# EAGLE design pwm4 (EAGLE 6.5.0)
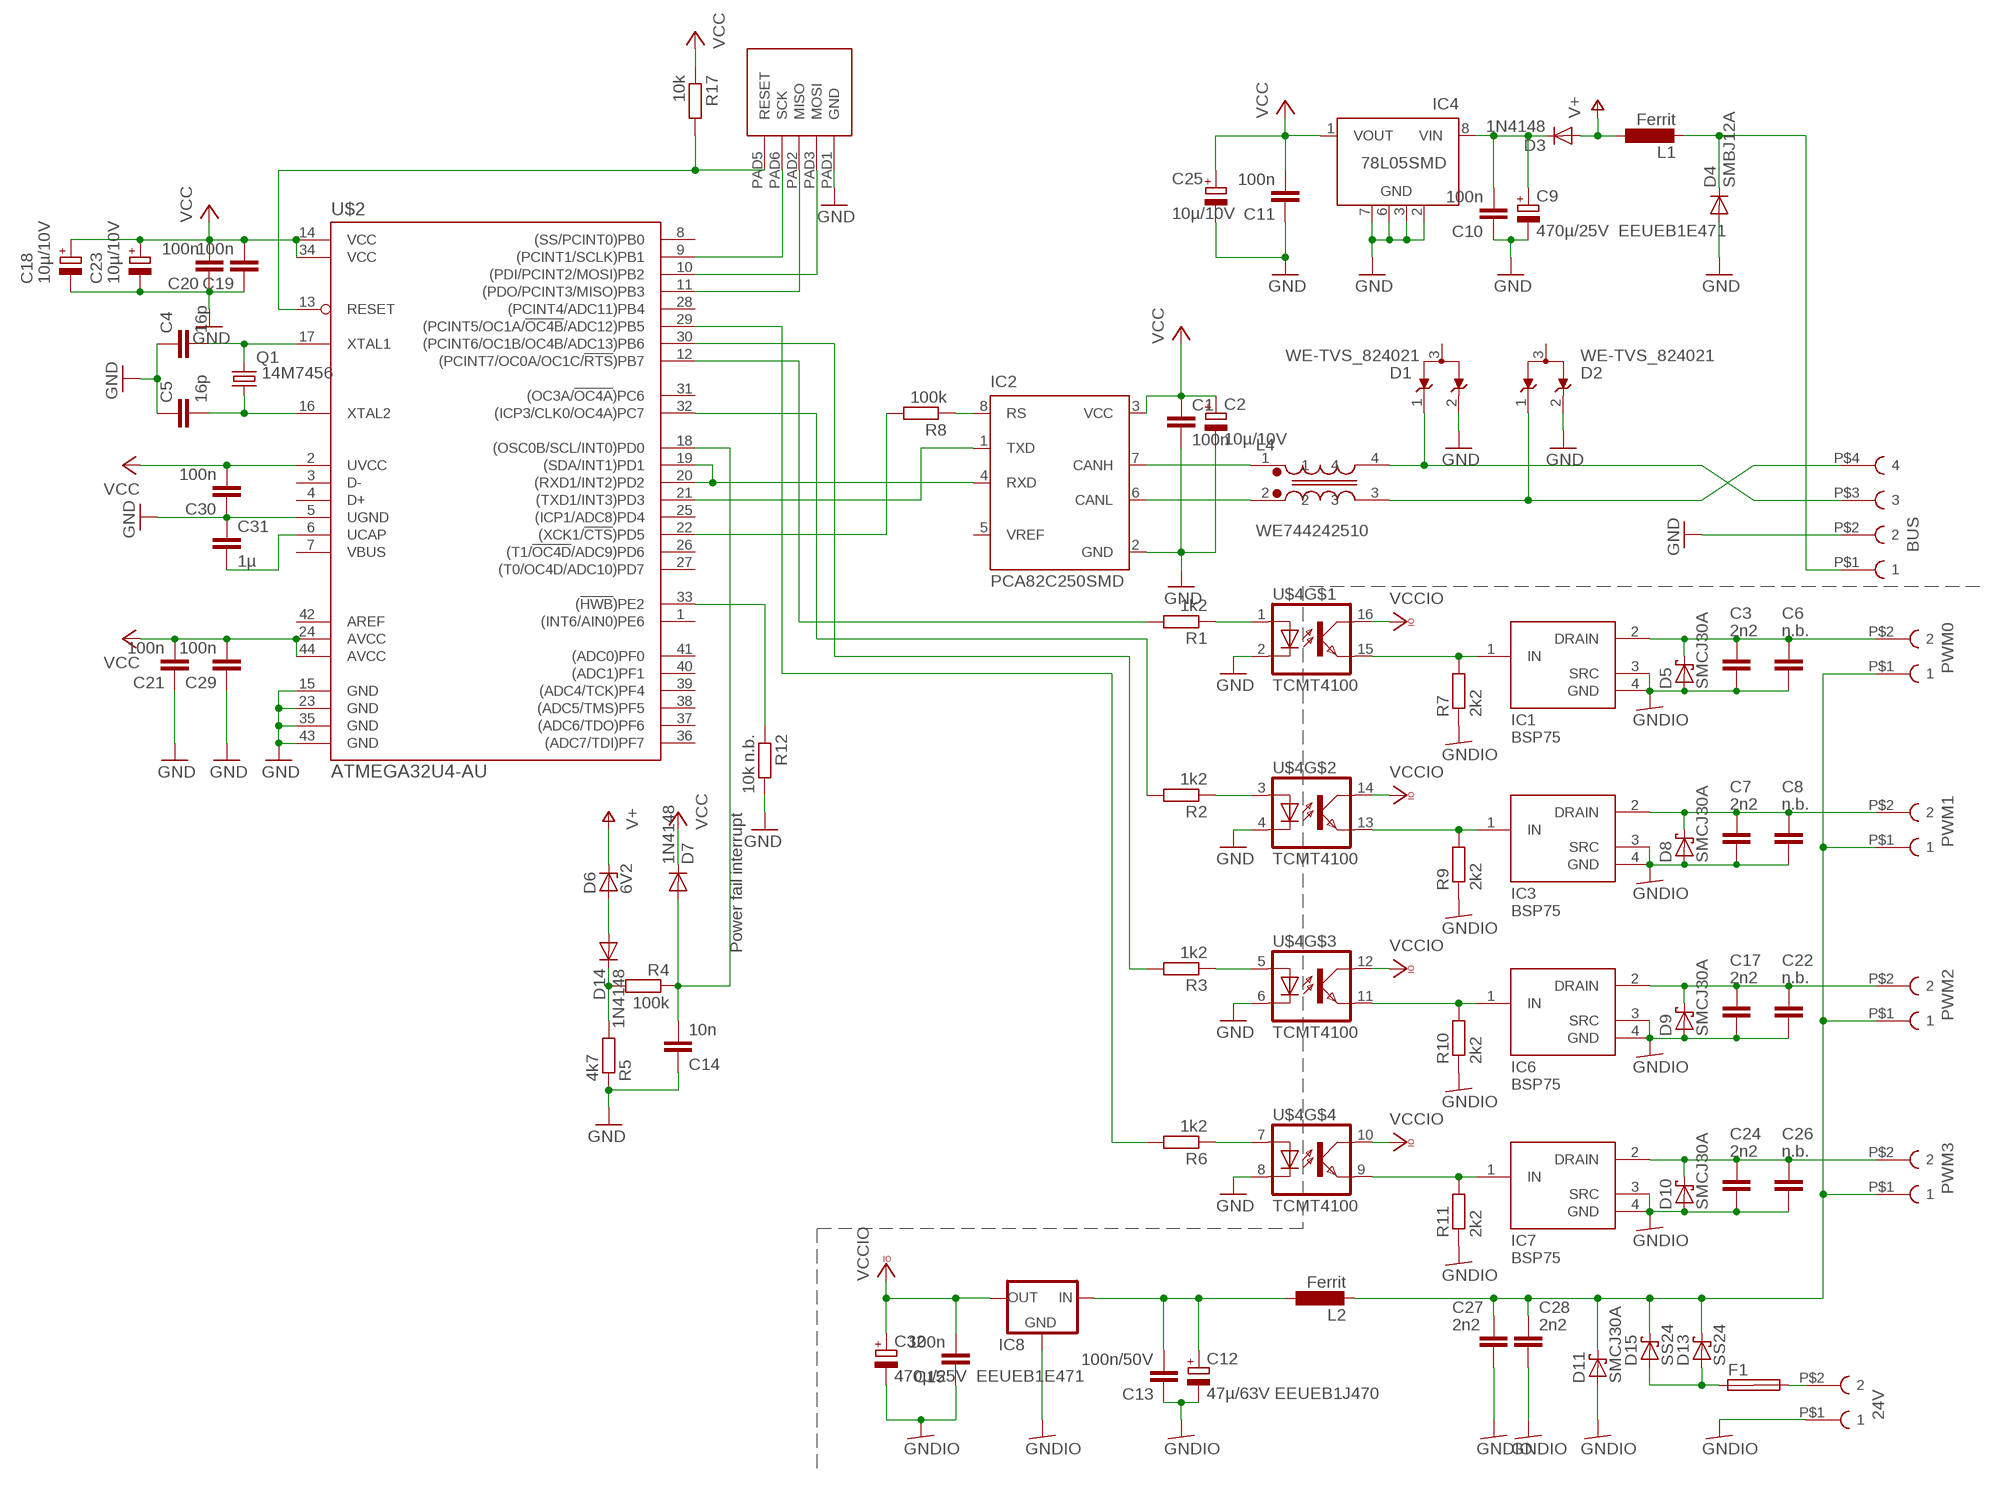
[diagram p0: schematic, sheet 1]

## Parts
24V  TBG-3.5-PW-2P  [TBG-3.5-PW-2P]
BUS  TBG-3.5-PW-4P  [TBG-3.5-PW-4P]
C1  100n  C-EUC0603  [C0603]
C2  10µ/10V  CPOL-EUA/3216-18W  [A/3216-18W]
C3  2n2  C-EU025-040X050  [C025-040X050]
C4  16p  C-EUC0603  [C0603]
C5  16p  C-EUC0603  [C0603]
C6  n.b.  C-EU025-040X050  [C025-040X050]
C7  2n2  C-EU025-040X050  [C025-040X050]
C8  n.b.  C-EU025-040X050  [C025-040X050]
C9  470µ/25V EEUEB1E471  CPOL-EUE5-10.5  [E5-10,5]
C10  100n  C-EUC0603  [C0603]
C11  100n  C-EUC0603  [C0603]
C12  47µ/63V EEUEB1J470  CPOL-EUE3.5-8  [E3,5-8]
C13  100n/50V  C-EUC0603  [C0603]
C14  10n  C-EUC0603  [C0603]
C15  100n  C-EUC0603  [C0603]
C17  2n2  C-EU025-040X050  [C025-040X050]
C18  10µ/10V  CPOL-EUA/3216-18W  [A/3216-18W]
C19  100n  C-EUC0603  [C0603]
C20  100n  C-EUC0603  [C0603]
C21  100n  C-EUC0603  [C0603]
C22  n.b.  C-EU025-040X050  [C025-040X050]
C23  10µ/10V  CPOL-EUA/3216-18W  [A/3216-18W]
C24  2n2  C-EU025-040X050  [C025-040X050]
C25  10µ/10V  CPOL-EUA/3216-18W  [A/3216-18W]
C26  n.b.  C-EU025-040X050  [C025-040X050]
C27  2n2  C-EU025-040X050  [C025-040X050]
C28  2n2  C-EU025-040X050  [C025-040X050]
C29  100n  C-EUC0603  [C0603]
C30  100n  C-EUC0603  [C0603]
C31  1µ  C-EUC1210K  [C1210K]
C32  470µ/25V EEUEB1E471  CPOL-EUE5-10.5  [E5-10,5]
D1  WE-TVS_824021  [WE-TVS_SOT23-3L]
D2  WE-TVS_824021  [WE-TVS_SOT23-3L]
D3  1N4148  DIODE-SOD80C  [SOD80C]
D4  SMBJ12A  DIODE-SMB  [SMB]
D5  SMCJ30A  SCHOTTKY-DIODESMC  [SMC]
D6  6V2  ZENER-DIODESOD80C  [SOD80C]
D7  1N4148  DIODE-SOD80C  [SOD80C]
D8  SMCJ30A  SCHOTTKY-DIODESMC  [SMC]
D9  SMCJ30A  SCHOTTKY-DIODESMC  [SMC]
D10  SMCJ30A  SCHOTTKY-DIODESMC  [SMC]
D11  SMCJ30A  SCHOTTKY-DIODESMC  [SMC]
D13  SS24  SCHOTTKY-DIODESMD  [SMB]
D14  1N4148  DIODE-SOD80C  [SOD80C]
D15  SS24  SCHOTTKY-DIODESMD  [SMB]
F1  SHK20L  [SHK20L]
IC1  BSP75  [SOT223]
IC2  PCA82C250SMD  [SO8]
IC3  BSP75  [SOT223]
IC4  78L05SMD  [SO08]
IC6  BSP75  [SOT223]
IC7  BSP75  [SOT223]
IC8  78XXS  [78XXS]
L1  Ferrit  L-EUL1806  [L1806]
L2  Ferrit  L-EUL1806  [L1806]
L4  WE744242510  WE-SLM  [WE-SLM]
PWM0  TBG-3.5-PW-2P  [TBG-3.5-PW-2P]
PWM1  TBG-3.5-PW-2P  [TBG-3.5-PW-2P]
PWM2  TBG-3.5-PW-2P  [TBG-3.5-PW-2P]
PWM3  TBG-3.5-PW-2P  [TBG-3.5-PW-2P]
Q1  14M7456  CRYSTALSM49  [SM49]
R1  1k2  R-EU_R0603  [R0603]
R2  1k2  R-EU_R0603  [R0603]
R3  1k2  R-EU_R0603  [R0603]
R4  100k  R-EU_R0603  [R0603]
R5  4k7  R-EU_R0603  [R0603]
R6  1k2  R-EU_R0603  [R0603]
R7  2k2  R-EU_R0603  [R0603]
R8  100k  R-EU_R0603  [R0603]
R9  2k2  R-EU_R0603  [R0603]
R10  2k2  R-EU_R0603  [R0603]
R11  2k2  R-EU_R0603  [R0603]
R12  10k n.b.  R-EU_R0603  [R0603]
R17  10k  R-EU_R0603  [R0603]
U$1  ATMEL_ISP  [ATMEL_ISP]
U$2  ATMEGA32U4-AU  [TQFP44]
U$4  TCMT4100  [SOIC16]

## Nets
#RESET: R17.2 U$1.PAD5(RESET) U$2.13(RESET)
B+: BUS.P$3 D1.1 L4.4
B-: BUS.P$4 D2.1 L4.3
GND: BUS.P$2 C1.2 C2.- C4.1 C5.1 C9.- C10.1 C11.1 C14.1 C18.- C19.1 C20.1 C21.1 C23.- C25.- C29.1 C30.1 C31.1 D1.2 D2.2 D4.A IC2.2(GND) IC4.2(GND) IC4.3(GND) IC4.6(GND) IC4.7(GND) R5.1 R12.2 U$1.PAD1(GND) U$2.5(UGND) U$2.15(GND) U$2.23(GND) U$2.35(GND) U$2.43(GND) U$4.2(C) U$4.4(C) U$4.6(C) U$4.8(C)
GNDIO: 24V.P$1 C3.1 C6.1 C7.1 C8.1 C12.- C13.1 C15.1 C17.1 C22.1 C24.1 C26.1 C27.1 C28.1 C32.- D5.A D8.A D9.A D10.A D11.A IC1.3(SRC) IC1.4(GND) IC3.3(SRC) IC3.4(GND) IC6.3(SRC) IC6.4(GND) IC7.3(SRC) IC7.4(GND) IC8.GND R7.1 R9.1 R10.1 R11.1
MISO: U$1.PAD2(MISO) U$2.11((PDO/PCINT3/MISO)PB3)
MOSI: U$1.PAD3(MOSI) U$2.10((PDI/PCINT2/MOSI)PB2)
N$1: R8.2 U$2.22((XCK1/!CTS!)PD5)
N$2: C3.2 C6.2 D5.C IC1.2(DRAIN) PWM0.P$2
N$3: IC2.1(TXD) U$2.21((TXD1/INT3)PD3)
N$4: C9.+ C10.2 D3.C IC4.8(VIN)
N$9: C7.2 C8.2 D8.C IC3.2(DRAIN) PWM1.P$2
N$10: IC2.7(CANH) L4.1
N$11: R1.1 U$4.1(A)
N$12: IC2.4(RXD) U$2.19((SDA/INT1)PD1) U$2.20((RXD1/INT2)PD2)
N$13: C17.2 C22.2 D9.C IC6.2(DRAIN) PWM2.P$2
N$14: C24.2 C26.2 D10.C IC7.2(DRAIN) PWM3.P$2
N$15: C4.2 Q1.2 U$2.17(XTAL1)
N$16: C5.2 Q1.1 U$2.16(XTAL2)
N$17: IC2.6(CANL) L4.2
N$18: C12.+ C13.2 IC8.IN L2.1
N$19: C27.2 C28.2 D11.C D13.C D15.C L2.2 PWM0.P$1 PWM1.P$1 PWM2.P$1 PWM3.P$1
N$20: BUS.P$1 D4.C L1.2
N$21: 24V.P$2 F1.2A
N$22: D6.A D14.A
N$23: D13.A D15.A F1.1A
N$24: R2.1 U$4.3(A)
N$25: R3.1 U$4.5(A)
N$26: R6.1 U$4.7(A)
N$27: IC2.8(RS) R8.1
N$28: D14.C R4.2 R5.2
N$29: IC1.1(IN) R7.2 U$4.15(EMIT)
N$30: IC3.1(IN) R9.2 U$4.13(EMIT)
N$31: IC6.1(IN) R10.2 U$4.11(EMIT)
N$32: IC7.1(IN) R11.2 U$4.9(EMIT)
N$36: C31.2 U$2.6(UCAP)
N$37: R12.1 U$2.33((!HWB!)PE2)
N$39: C14.2 D7.A R4.1 U$2.18((OSC0B/SCL/INT0)PD0)
PWM0: R1.2 U$2.12((PCINT7/OC0A/OC1C/!RTS!)PB7)
PWM1: R2.2 U$2.32((ICP3/CLK0/OC4A)PC7)
PWM2: R3.2 U$2.30((PCINT6/OC1B/OC4B/ADC13)PB6)
PWM3: R6.2 U$2.29((PCINT5/OC1A/!OC4B!/ADC12)PB5)
SCK: U$1.PAD6(SCK) U$2.9((PCINT1/SCLK)PB1)
V+: D3.A D6.C L1.1
VCC: C1.1 C2.+ C11.2 C18.+ C19.2 C20.2 C21.2 C23.+ C25.+ C29.2 C30.2 D7.C IC2.3(VCC) IC4.1(VOUT) R17.1 U$2.2(UVCC) U$2.14(VCC) U$2.24(AVCC) U$2.34(VCC) U$2.44(AVCC)
VCCIO: C15.2 C32.+ IC8.OUT U$4.10(COL) U$4.12(COL) U$4.14(COL) U$4.16(COL)
Unconnected: D1.3(GND) D2.3(GND) F1.1B F1.2B IC2.5(VREF) IC4.4(NC) IC4.5(NC) U$2.1((INT6/AIN0)PE6) U$2.3(D-) U$2.4(D+) U$2.7(VBUS) U$2.8((SS/PCINT0)PB0) U$2.25((ICP1/ADC8)PD4) U$2.26((T1/!OC4D!/ADC9)PD6) U$2.27((T0/OC4D/ADC10)PD7) U$2.28((PCINT4/ADC11)PB4) U$2.31((OC3A/!OC4A!)PC6) U$2.36((ADC7/TDI)PF7) U$2.37((ADC6/TDO)PF6) U$2.38((ADC5/TMS)PF5) U$2.39((ADC4/TCK)PF4) U$2.40((ADC1)PF1) U$2.41((ADC0)PF0) U$2.42(AREF)

## Notes on the sheet
- Power fail interrupt

## Library data of the parts
24V PWM0 PWM1-PWM3 = mylib:TBG-3.5-PW-2P
BUS = mylib:TBG-3.5-PW-4P
C1 C3-C8 C10 C11 C13-C15 C17 C19-C22 C24 C26-C30 = resistor:C-EU: CAPACITOR, European symbol
C2 C9 C12 C18 C23 C25 C32 = rcl:CPOL-EU: POLARIZED CAPACITOR, European symbol
C31 = rcl:C-EU: CAPACITOR, European symbol
D1 D2 = EagleLibrary_Wuerth_Elektronik_eiSos_V6_20140807:WE-TVS_824021: TVS Diode Array WE-TVS, Standard Series - Low capazity - No leakage current - Low clamping voltage - high ESD voltage protection - Uni- and bidirectional protection -- DC Distribution -- Headsets and Accessoires -- PDAs -- Digital Cameras -- MP3-Players -- Touch Panels <http://katalog.we-online.de/media/images/eisos/VarTVS_highspeed_pf2.jpg.jpg> Details see: http://katalog.we-online.de/en/pbs/WE-TVS_High_Speed? Updated by Dan Xu 2014-07-11 2014 (C) Würth Elektronik
D3 D4 D7 D14 = diode:DIODE-: DIODE
D5 D8-D11 D13 D15 = diode:SCHOTTKY-DIODE: Schottky Diode
D6 = diode:ZENER-DIODE: Z-Diode
F1 = fuse:SHK20L: FUSE HOLDER 5 x 20 mm, SH contact, SHH1 Schukat, E1073 Buerklin; OC_FARNELL: unknown; OC_NEWARK: unknown
IC1 IC3 IC6 IC7 = mylib:BSP75
IC2 = mylib:PCA82C250: CAN CONTROLLER INTERFACE
IC4 = linear:78L*SMD: Positive VOLTAGE REGULATOR
IC8 = v-reg:78XXS: VOLTAGE REGULATOR
L1 L2 = mylib:L-EU: INDUCTOR, European symbol
L4 = EagleLibrary_Wuerth_Elektronik_eiSos_V6_20140807:WE-SLM: SMD Common Mode Line Filter WE-SLM - Small size - Low Profile - High Impedance - High current capability up to 300 mA -- USB -- CAN -- Firewire -- Data Lines -- Power supply systems -- Signal Lines <http://katalog.we-online.de/media/images/eisos/IndSLM_pf2.jpg> Details see: http://katalog.we-online.de/en/pbs/WE-SLM?? Updated by Dan Xu 2014-07-11 2014 (C) Würth Elektronik
Q1 = crystal:CRYSTAL: CRYSTAL; OC_FARNELL: unknown; OC_NEWARK: unknown
R1-R12 R17 = resistor:R-EU_: RESISTOR, European symbol
U$1 = mylib:ATMEL_ISP
U$2 = mega32U4:ATMEGA32U4-AU: ATMega32U4-AU Library by: http://projects.weber-itam.de
U$4 = mylib:TCMT4100

## Net classes
0 default: clearance 0.205 mm

## Board
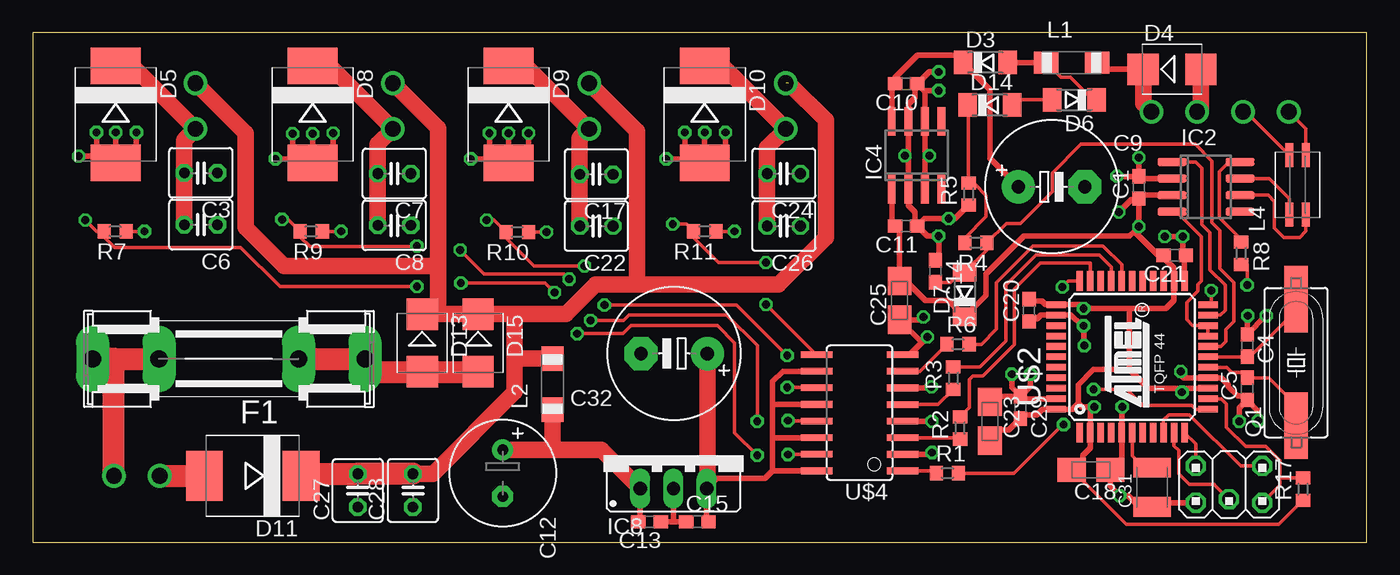
[diagram p1: board, top side]
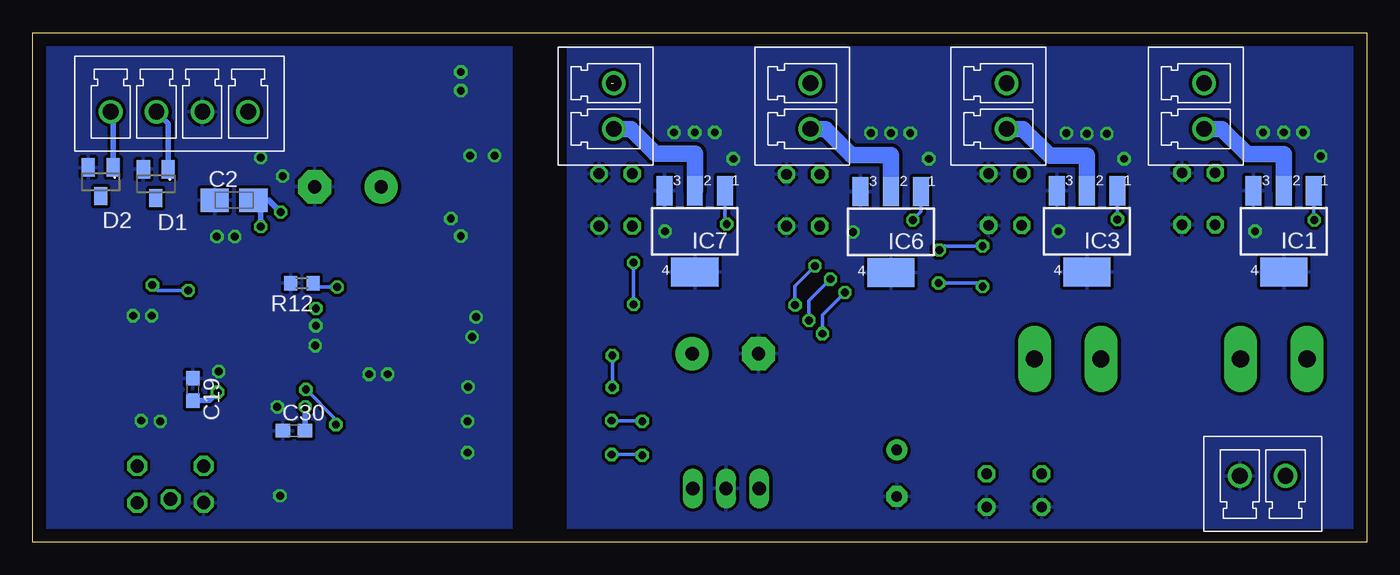
[diagram p2: board, bottom side, seen from below]

Size 101.96 x 38.96 mm. Coordinates in mm from the lower left corner, seen from the top.
Outline: 0,0 101.96,0 101.96,38.96 0,38.96 0,0
Copper layers (1*16): Top 0.035mm / dielectric 1.5mm / Bottom 0.035mm
Design rules "Bilex DRU *": minimum track width 10mil, minimum drill 23mil, track to track 10mil, track to pad 10mil, pad to pad 10mil, via to via 10mil, smd to smd 10mil, copper to edge 40mil, drill to drill 8mil, minimum pad ring 10mil, minimum via ring 8mil, stop-mask expansion 4mil, vias tented up to drill 0mil, thermal gap 10mil

### Footprints (pad centres in the part's own frame; a part is rotated, then mirrored left to right if it is on the bottom)
TBG-3.5-PW-2P = drill 1.2: P$1 0,0; P$2 3.5,0
TBG-3.5-PW-4P = drill 1.2: P$1 0,0; P$2 3.5,0; P$3 7,0; P$4 10.5,0
C0603 = smd 1.1 x 1: 1 -0.85,0; 2 0.85,0
A/3216-18W = smd 2.15 x 1.8: + 1.475,0; - -1.475,0
C025-040X050 = drill 0.813 octagon: 1 -1.27,0; 2 1.27,0
E5-10,5 = drill 1.016 pad 2.54: + -2.54,0 | drill 1.016 pad 2.54 octagon: - 2.54,0
E3,5-8 = drill 0.813 pad 1.6: + -1.778,0 | drill 0.813 pad 1.6 octagon: - 1.778,0
C1210K = smd 1.5 x 2.9: 1 -1.5,0; 2 1.5,0
WE-TVS_SOT23-3L = smd 1 x 1.4: 1 -0.95,-1.1; 2 0.95,-1.1; 3 0,1.1
SOD80C = smd 1.4 x 1.8: A 1.7,0; C -1.7,0
SMB = smd 2.4 x 2.4: A 2.2,0; C -2.2,0
SMC = smd 2.8 x 3.8: A 3.7,0; C -3.7,0
SHK20L = drill 1.321 pad 2.54 long: 1A -10.414,0; 1B -5.334,0; 2A 10.414,0; 2B 5.334,0
SOT223 = smd 1.219 x 2.235: 1 -2.311,-3.099; 2 0,-3.099; 3 2.311,-3.099 | smd 3.6 x 2.2: 4 0,3.099
SO8 = smd 0.6 x 2.2: 1 -1.905,-2.6; 2 -0.635,-2.6; 3 0.635,-2.6; 4 1.905,-2.6; 5 1.905,2.6; 6 0.635,2.6; 7 -0.635,2.6; 8 -1.905,2.6
SO08 = smd 0.6 x 2.2: 1 -1.905,-2.6; 2 -0.635,-2.6; 3 0.635,-2.6; 4 1.905,-2.6; 5 1.905,2.6; 6 0.635,2.6; 7 -0.635,2.6; 8 -1.905,2.6
78XXS = drill 1.016 long: GND 0,-2.54; IN -2.54,-2.54; OUT 2.54,-2.54
L1806 = smd 1.9 x 1.7: 1 -0.68,0; 2 3.22,0
WE-SLM = smd 1.85 x 0.6: 1 -2.28,0.63; 2 -2.28,-0.62; 3 2.27,-0.62; 4 2.27,0.63
SM49 = smd 5.08 x 1.778: 1 -4.826,0; 2 4.826,0
R0603 = smd 1 x 1.1: 1 -0.85,0; 2 0.85,0
ATMEL_ISP = drill 1.016 octagon: PAD1 1.397,-2.54; PAD2 -1.41,-2.54; PAD3 1.13,0; PAD5 1.41,2.54; PAD6 -1.41,2.54
TQFP44 = smd 1.5 x 0.5: 1 -5.8,4; 2 -5.8,3.2; 3 -5.8,2.4; 4 -5.8,1.6; 5 -5.8,0.8; 6 -5.8,0; 7 -5.8,-0.8; 8 -5.8,-1.6; 9 -5.8,-2.4; 10 -5.8,-3.2; 11 -5.8,-4; 23 5.8,-4; 24 5.8,-3.2; 25 5.8,-2.4; 26 5.8,-1.6; 27 5.8,-0.8; 28 5.8,0; 29 5.8,0.8; 30 5.8,1.6; 31 5.8,2.4; 32 5.8,3.2; 33 5.8,4 | smd 0.5 x 1.5: 12 -4,-5.8; 13 -3.2,-5.8; 14 -2.4,-5.8; 15 -1.6,-5.8; 16 -0.8,-5.8; 17 0,-5.8; 18 0.8,-5.8; 19 1.6,-5.8; 20 2.4,-5.8; 21 3.2,-5.8; 22 4,-5.8; 34 4,5.8; 35 3.2,5.8; 36 2.4,5.8; 37 1.6,5.8; 38 0.8,5.8; 39 0,5.8; 40 -0.8,5.8; 41 -1.6,5.8; 42 -2.4,5.8; 43 -3.2,5.8; 44 -4,5.8
SOIC16 = smd 0.508 x 2.413: 1 -4.445,-3.281; 2 -3.185,-3.281; 3 -1.915,-3.281; 4 -0.645,-3.281; 5 0.625,-3.281; 6 1.895,-3.281; 7 3.165,-3.281; 8 4.435,-3.281; 9 4.445,3.281; 10 3.175,3.281; 11 1.905,3.281; 12 0.635,3.281; 13 -0.635,3.281; 14 -1.905,3.281; 15 -3.175,3.281; 16 -4.445,3.281

### Placement (x,y rotation side)
24V  9.7,5.08 0 bottom
BUS  85.5,32.92 180 bottom
C1  84.53,27.13 90 top
C2  86.56,26.16 0 bottom
C3  12.85,28.24 180 top
C4  92.81,15.04 270 top
C5  92.81,11.73 90 top
C6  12.85,24.28 180 top
C7  27.64,28.19 180 top
C8  27.64,24.23 180 top
C9  77.88,27.18 0 top
C10  66.75,35.05 180 top
C11  66.75,24.18 180 top
C12  35.92,5.28 270 top
C13  47.14,1.57 180 top
C14  68.99,20.73 270 top
C15  50.8,1.57 0 top
C17  43.08,28.14 180 top
C18  80.87,5.54 180 top
C19  89.71,11.68 270 bottom
C20  76.15,17.73 90 top
C21  87.27,21.95 180 top
C22  43.08,24.18 180 top
C23  73.15,9.25 270 top
C24  57.4,28.19 180 top
C25  66.24,18.49 90 top
C26  57.4,24.18 180 top
C27  24.84,3.96 90 top
C28  29.06,3.96 90 top
C29  75.49,10.31 270 top
C30  81.99,8.53 0 bottom
C31  85.55,4.22 90 top
C32  49.02,14.43 180 top
D1  92.54,27.41 180 bottom
D2  96.76,27.57 180 bottom
D3  72.8,36.68 0 top
D4  87.07,36.17 0 top
D5  6.35,32.72 270 top
D6  79.6,33.83 180 top
D7  71.22,18.95 90 top
D8  21.39,32.72 270 top
D9  36.37,32.72 270 top
D10  51.36,32.72 270 top
D11  16.81,5.08 180 top
D13  29.77,15.24 270 top
D14  73.15,33.43 0 top
D15  34.04,15.24 270 top
F1  14.99,14.02 180 top
IC1  6.35,23.77 180 bottom
IC2  89.66,27.18 270 top
IC3  21.39,23.77 180 bottom
IC4  67.55,29.58 0 top
IC6  36.37,23.72 180 bottom
IC7  51.36,23.77 180 bottom
IC8  48.97,6.65 0 top
L1  78.13,36.68 0 top
L2  39.73,10.82 90 top
L4  96.67,27.33 90 top
PWM0  12.45,35.1 270 bottom
PWM1  27.53,35.1 270 bottom
PWM2  42.52,35.1 270 bottom
PWM3  57.56,35.1 270 bottom
Q1  96.56,13.74 90 top
R1  69.9,5.28 0 top
R2  70.87,8.74 90 top
R3  70.36,12.55 90 top
R4  72.09,22.91 180 top
R5  71.53,26.62 90 top
R6  70.71,15.14 0 top
R7  6.3,23.77 180 top
R8  92.35,22.1 270 top
R9  21.29,23.77 180 top
R10  37.03,23.72 180 top
R11  51.36,23.77 180 top
R12  81.38,19.81 180 bottom
R17  97.08,4.06 90 top
U$1  91.43,4.42 270 top
U$2  84.02,14.17 90 top
U$4  63.2,9.91 90 top

### Tracks (layer width: path | path; a pad name or v marks a point on that pad's centre or on a via)
#RESET
  Top 0.254: 95.3,4.83 95.3,6.25 94.23,7.32 92.71,7.32 91.24,8.79 91.24,10.57 90.83,10.97 U$2.13 | 95.3,4.83 95.3,4.35 U$1.PAD5 | R17.2 95.39,4.91 95.3,4.83
B+
  Top 0.254: L4.4 92.72,32.92 BUS.P$3
  Bottom 0.406: BUS.P$3 91.59,32.02 D1.1
B-
  Top 0.254: L4.3 97.29,31.62 BUS.P$4
  Bottom 0.406: BUS.P$4 95.81,32.73 D2.1
GND  (via drill 0.6)
  Top 0.254: 80.31,15.09 v80.37,15.04
  Top 0.406: IC4.3 68.19,29.23 v68.53,29.57 68.19,29.91 IC4.6 68.19,34.46 | 68.19,34.46 C10.1 | v69.24,35.97 68.52,35.97 C10.1 | v69.24,34.54 68.27,34.54 68.19,34.46 | C10.1 67.41,34.86 67.41,33.98 66.92,33.49 IC4.7 66.92,29.84 v66.65,29.57 66.92,29.3 IC4.2 66.92,25.74 67.41,25.25 67.41,24.37 C11.1 | v69.24,23.42 68.36,23.42 C11.1 | U$4.8 67.02,14.34 67.94,15.27 | 67.94,15.27 v68.38,15.7 | v68.07,17.22 67.87,17.02 C25.- 66.24,16.97 67.94,15.27 | 80.31,15.09 v80.31,16.56 80.16,16.56 79.35,17.37 U$2.35 77.06,17.37 76.76,17.07 76.34,17.07 C20.1 | 69.19,23.37 v69.24,23.42 | v87.73,13.06 87.73,12.8 87.96,12.57 U$2.15 90.86,12.57 91.39,12.04 91.39,11.89 92.1,11.18 92.52,11.18 C5.1 | v83.26,10.36 83.22,10.36 U$2.5 83.22,6.41 C18.- 82.35,4.26 v83.06,3.56 83.72,3.56 84.48,2.79 85.47,2.79 C31.1 85.86,3.03 U$1.PAD1 | C5.1 92.2,10.28 v92.2,9.25 | v93.67,9.3 93.67,10.02 C5.1 | v92.86,17.32 92.81,17.27 C4.1 94.25,17.32 v94.28,17.32 | U$2.43 75.68,10.97 C29.1 | C23.- 73.59,11.16 C29.1 | C29.1 74.83,11.82 v74.83,12.85 | v76.25,12.85 76.25,11.92 C29.1 | U$4.6 68.59,11.8 v68.68,11.89 | U$4.4 68.72,9.26 v68.73,9.25 | U$4.2 68.59,6.72 v68.73,6.86 | C14.1 69.24,21.83 v69.24,23.42 | v84.53,29.41 C1.2 | C1.2 84.69,27.81 IC2.2 | U$2.23 88.02,21.84 C21.1 87.88,22.19 v87.88,23.37 v86.51,23.37 | C11.1 68.16,24.74 v70,24.74 70.5,24.74 R5.1 | C1.2 82.87,27.98 v82.86,27.99
  Top 1.27: D4.A 89.27,33.19 BUS.P$2
  pour Bottom: 101.8,38.81 101.8,0.15 65.38,0.15 65.38,38.81
GNDIO  (via drill 0.6)
  Top 0.254: R10.1 v39.27,23.72 | R11.1 v53.65,23.77 | R7.1 v8.53,23.77 | R9.1 v23.57,23.77
  Top 0.406: v7.92,31.34 7.92,29.02 D5.A | v3.5,29.52 6.35,29.52 D5.A | v4.88,31.34 4.88,29.02 D5.A | v6.35,31.34 D5.A | v22.96,31.29 22.96,29.02 D8.A | v19.86,31.24 19.86,29.02 D8.A | v18.54,29.31 21.39,29.31 D8.A | v21.39,31.24 D8.A | v37.9,31.29 37.9,29.02 D9.A | v34.9,31.29 34.9,29.02 D9.A | v33.48,29.31 36.37,29.31 D9.A | v36.37,31.29 D9.A | v52.93,31.34 52.93,29.02 D10.A | v49.84,31.34 49.84,29.02 D10.A | v48.41,29.31 51.36,29.31 D10.A | v51.36,31.34 D10.A | C13.1 C15.1 48.97,1.57 IC8.GND
  Top 1.676: 24V.P$1 D11.A
  pour Bottom: 0.15,0.15 61.01,0.15 61.01,38.81 0.15,38.81
MISO
  Top 0.254: U$2.11 88.89,7.51 U$1.PAD2
MOSI
  Top 0.254: U$1.PAD3 90.46,4.26 90.35,4.37 90.3,4.42 88.39,4.42 87.58,5.23 87.58,7.01 87.22,7.37 U$2.10
N$1  (via drill 0.6)
  Top 0.254: U$2.22 89.76,18.23 90.07,18.23 v90.07,19.25 | R8.2 92.81,21.25 v92.81,19.66
  Bottom 0.254: v90.07,19.25 92.41,19.25 v92.81,19.66
N$2
  Top 1.27: D5.C 7.63,36.41 PWM0.P$2 11.58,30.74 C3.2 C6.2
  Bottom 1.27: IC1.2 6.35,29.67 9.14,29.67 11.08,31.6 PWM0.P$2
N$3
  Top 0.254: 89.87,17.32 U$2.21 90.78,17.37 91.14,17.73 91.14,19.66 89.97,20.83 89.97,23.67 89.36,24.28 89.36,28.6 88.88,29.08 IC2.1
N$4
  Top 0.406: IC4.8 65.65,34.8 C10.2 65.9,35.52 67.61,37.24 70.61,37.24 71.1,36.75 D3.C 73.15,34.62 73.15,29.36 C9.+
N$9
  Top 1.27: D8.C 22.72,36.41 PWM1.P$2 26.36,30.43 C7.2 C8.2
  Bottom 1.27: IC3.2 21.39,29.57 24.23,29.57 26.27,31.6 PWM1.P$2
N$10
  Top 0.254: IC2.7 94.51,27.81 96.04,26.28 L4.1
N$11
  Top 0.254: U$4.1 68.87,5.46 R1.1
N$12
  Top 0.254: U$2.19 U$2.20 88.63,16.57 88.19,17.02 88.19,18.34 89.05,19.2 89.05,19.71 89.31,19.96 89.31,23.37 87.4,25.27 IC2.4
N$13
  Top 1.27: D9.C 37.71,36.41 PWM2.P$2 41.81,30.89 C17.2 C22.2
  Bottom 1.27: IC6.2 36.37,29.62 39.37,29.62 41.36,31.6 PWM2.P$2
N$14
  Top 1.27: D10.C 52.74,36.41 PWM3.P$2 56.13,30.18 C24.2 C26.2
  Bottom 1.27: IC7.2 51.36,29.72 54.36,29.72 56.24,31.6 PWM3.P$2
N$15
  Top 0.254: U$2.17 92.8,14.17 C4.2 93.03,14.19 96.11,17.27 96.11,18.12 Q1.2
N$16
  Top 0.254: U$2.16 91.28,13.37 91.64,13.01 92.41,13.01 92.81,12.6 C5.2 94.45,12.59 96.06,10.97 96.06,9.41 Q1.1
N$17
  Top 0.254: IC2.6 94.41,26.54 94.89,26.06 94.89,24.03 95.61,23.32 96.83,23.32 97.29,23.79 L4.2
N$18
  Top 0.406: IC8.IN 46.43,1.71 C13.2
  Top 1.27: C12.+ 39.57,7.06 39.73,7.06 | 39.73,7.06 43.48,7.06 IC8.IN | L2.1 39.73,7.06
N$19  (1 unrouted)
  Top 1.27: PWM1.P$1 30.99,31.65 30.99,21.13 | PWM0.P$1 16.26,31.29 16.26,24.08 19.2,21.13 30.99,21.13 | 57.76,35.1 60.6,32.26 60.6,23.32 57,19.71 46.18,19.71 | 46.18,19.71 43.03,19.71 40.76,17.44 36.83,17.44 | PWM2.P$1 46.18,31.45 46.18,19.71 | 26.6,5.23 C28.2 30.58,5.23 36.83,11.48 36.83,14.04 | 36.83,17.44 36.83,14.33 36.83,14.04 | 36.83,17.44 D15.C 30.84,17.44 | 30.84,17.44 D13.C | 30.99,21.13 30.99,17.59 30.84,17.44 | L2.2 36.83,14.04
  Top 1.676: D11.C 20.52,5.23 C27.2 C28.2
N$20
  Top 0.406: L1.2 81.86,36.17 D4.C
  Top 1.27: D4.C 84.87,33.54 BUS.P$1
N$21
  Top 1.676: 24V.P$2 6.2,14.02 | 6.2,14.02 9.65,14.02 | 6.2,14.02 F1.2A
N$22
  Top 0.254: D14.A 75.26,33.83 D6.A
N$23
  Top 1.676: D15.A D13.A 25.4,13.04 F1.1A 20.47,14.02
N$24
  Top 0.254: U$4.3 70.76,7.99 R2.1
N$25
  Top 0.254: U$4.5 69.19,10.53 R3.1
N$26
  Top 0.254: U$4.7 67.8,13.07 R6.1
N$27
  Top 0.254: IC2.8 91.42,29.08 90.68,28.35 90.68,24.84 92.35,23.16 R8.1
N$28
  Top 0.254: R4.2 71.23,23.28 72.85,24.89 72.85,26.52 72.03,27.33 71.67,27.33 R5.2 71.53,33.35 D14.C
N$29  (via drill 0.6)
  Top 0.254: v4.01,24.64 4.88,23.77 R7.2 5.45,23.35 6.25,22.55 15.9,22.55 18.9,19.56 v29.36,19.56 | U$4.15 59.89,6.71 v57.71,6.71 | v32.72,19.81 39.17,19.81 v39.88,19.1 | v41.6,15.95 45.11,15.95 45.72,16.56 52.32,16.56 53.65,15.24 53.65,8.38 v55.37,6.66
  Bottom 0.254: IC1.1 4.04,24.66 v4.01,24.64 | v55.37,6.66 55.42,6.71 v57.71,6.71 | v29.36,19.56 29.62,19.81 v32.72,19.81 | v39.88,19.1 41.6,17.37 v41.6,15.95
N$30  (via drill 0.6)
  Top 0.254: v19.05,24.69 19.52,24.69 R9.2 20.43,23.35 21.18,22.61 29.31,22.61 v29.36,22.66 | 59.89,9.25 U$4.13 59.89,9.3 v57.71,9.3 | v32.66,22.35 34.49,20.52 40.59,20.52 v41,20.12 | v42.62,16.97 45.16,16.97 45.57,17.37 53.03,17.37 55.37,15.04 v55.37,9.25
  Bottom 0.254: IC3.1 19.07,24.71 v19.05,24.69 | v55.37,9.25 55.42,9.3 v57.71,9.3 | v29.36,22.66 32.36,22.66 v32.66,22.35 | v41,20.12 42.62,18.49 v42.62,16.97
N$31  (via drill 0.6)
  Top 0.254: v34.7,24.64 35.27,24.64 R10.2 36.18,23.25 38.3,21.13 v42.16,21.13 | U$4.11 59.89,11.84 v57.66,11.84 | v43.69,18.14 53.8,18.14 v57.66,14.28
  Bottom 0.254: IC6.1 34.06,25.27 v34.7,24.64 | v57.66,14.28 v57.66,11.84 | v42.16,21.13 43.69,19.61 v43.69,18.14
N$32  (via drill 0.6)
  Top 0.254: v48.92,24.33 49.95,24.33 R11.2 50.51,23.3 52.43,21.39 v56.03,21.39 | U$4.9 59.87,14.35 v56.03,18.19
  Bottom 0.254: IC7.1 49.05,24.46 v48.92,24.33 | v56.03,21.39 v56.03,18.19
N$36
  Top 0.254: U$2.6 84.02,6.6 84.84,5.79 85.47,5.79 C31.2
N$37  (via drill 0.6)
  Top 0.254: v78.69,19.51 79.16,19.97 U$2.33
  Bottom 0.254: R12.1 80.23,19.51 v78.69,19.51
N$39
  Top 0.254: U$2.18 90.82,14.97 91.19,15.34 91.19,16.26 91.8,16.87 91.8,19.86 90.73,20.93 90.73,23.82 90.12,24.43 90.12,29.16 88.85,30.43 80.11,30.43 77.93,28.25 77.93,26.82 75.49,24.38 74.41,24.38 R4.1 72.94,22.36 D7.A 70.89,20.32 70.56,20.32 70.12,19.88 C14.2
PWM0  (via drill 0.6)
  Top 0.254: R1.2 74.98,5.28 78.69,8.99 v78.79,8.99 | U$2.12 88.89,10.17 88.59,10.46 84.84,10.46 83.62,11.68 v81.08,11.68
  Bottom 0.254: v81.08,11.68 78.79,9.4 v78.79,8.99
PWM1
  Top 0.254: R2.2 71.58,10.3 71.58,12.45 71.86,12.72 72.62,12.72 75.03,15.14 75.03,19.36 77.01,21.34 80.82,21.34 U$2.32
PWM2
  Top 0.254: R3.2 72.38,13.4 74.37,15.39 74.37,19.66 76.66,21.95 81.53,21.95 82.42,21.06 U$2.30
PWM3
  Top 0.254: R6.2 72.49,15.14 73.66,16.31 73.66,19.86 76.45,22.66 81.79,22.66 83.22,21.22 U$2.29
SCK
  Top 0.254: U$2.9 86.42,9.36 86.82,9.75 88.39,9.75 92.31,5.83 U$1.PAD6
V+
  Top 0.254: L1.1 78.57,35.56 79.3,35.56 81.03,33.83 D6.C
  Top 0.406: D3.A L1.1
VCC  (via drill 0.6)
  Top 0.254: R17.1 95.24,1.37 83.56,1.37 C18.+
  Top 0.406: IC4.1 65.65,24.43 C11.2 66.24,23.84 C25.+ 66.35,19.86 66.85,19.86 68.22,18.49 69.98,18.49 D7.C 72.85,18.87 72.85,20.52 75.74,23.42 83.82,23.42 84.18,23.77 | 83.82,17.88 v80.31,17.88 80.02,18.17 U$2.34 77.38,18.17 77.11,18.44 76.15,18.44 C20.2 | 83.82,17.88 86.61,17.88 87.22,18.49 U$2.24 87.22,20.98 86.42,21.78 C21.2 86,21.95 84.18,23.77 | 83.82,17.88 83.82,13.21 | 83.82,13.21 85.25,11.77 U$2.14 87.83,11.77 v87.83,11.48 | 83.82,13.21 81.08,13.21 79.91,12.04 79.91,10.62 | 79.91,10.62 79.46,10.17 U$2.44 77.18,10.17 76.76,9.75 75.78,9.75 C29.2 74.61,8.59 73.66,8.59 73.15,8.08 C23.+ | 79.91,10.62 80.16,10.36 v81.13,10.36 80.82,10.06 U$2.2 80.82,7.21 80.26,6.66 80.26,6.4 C18.+ | IC2.3 84.8,26.54 C1.1 | C1.1 84.47,26.21 83.97,26.21 v83.01,25.25 | C1.1 v84.53,24.13 84.18,23.77
  Bottom 0.406: C30.2 81.14,10.35 v81.13,10.36 | v87.83,11.48 88.48,10.83 C19.2 | C2.+ 83.92,26.16 v83.01,25.25 | v84.53,24.13 84.53,25.5 85.14,26.11
VCCIO
  Top 0.406: 59.89,5.44 U$4.16 56.54,5.46 | 56.54,5.46 56.54,8 | 56.54,8 56.54,10.54 | 56.54,10.54 56.54,12.29 57.33,13.08 U$4.10 | U$4.12 56.54,10.54 | U$4.14 56.54,8 | 56.54,5.46 55.96,4.88 52.27,4.88 IC8.OUT 51.51,1.71 C15.2
  Top 1.27: C32.+ 51.56,4.17 IC8.OUT